# EasyEDA Pro project PixelClock像素时钟-开源Pix24-O.eprj, schematic Schematic
Create Date: 2024-06-09; Page Name: P1; Project Name: EasyMatrix像素钟_Base; Schematic Name: Schematic; Update Date: 2024-07-29; Company: 嘉立创EDA; Page Size: A4; Version: V1.0
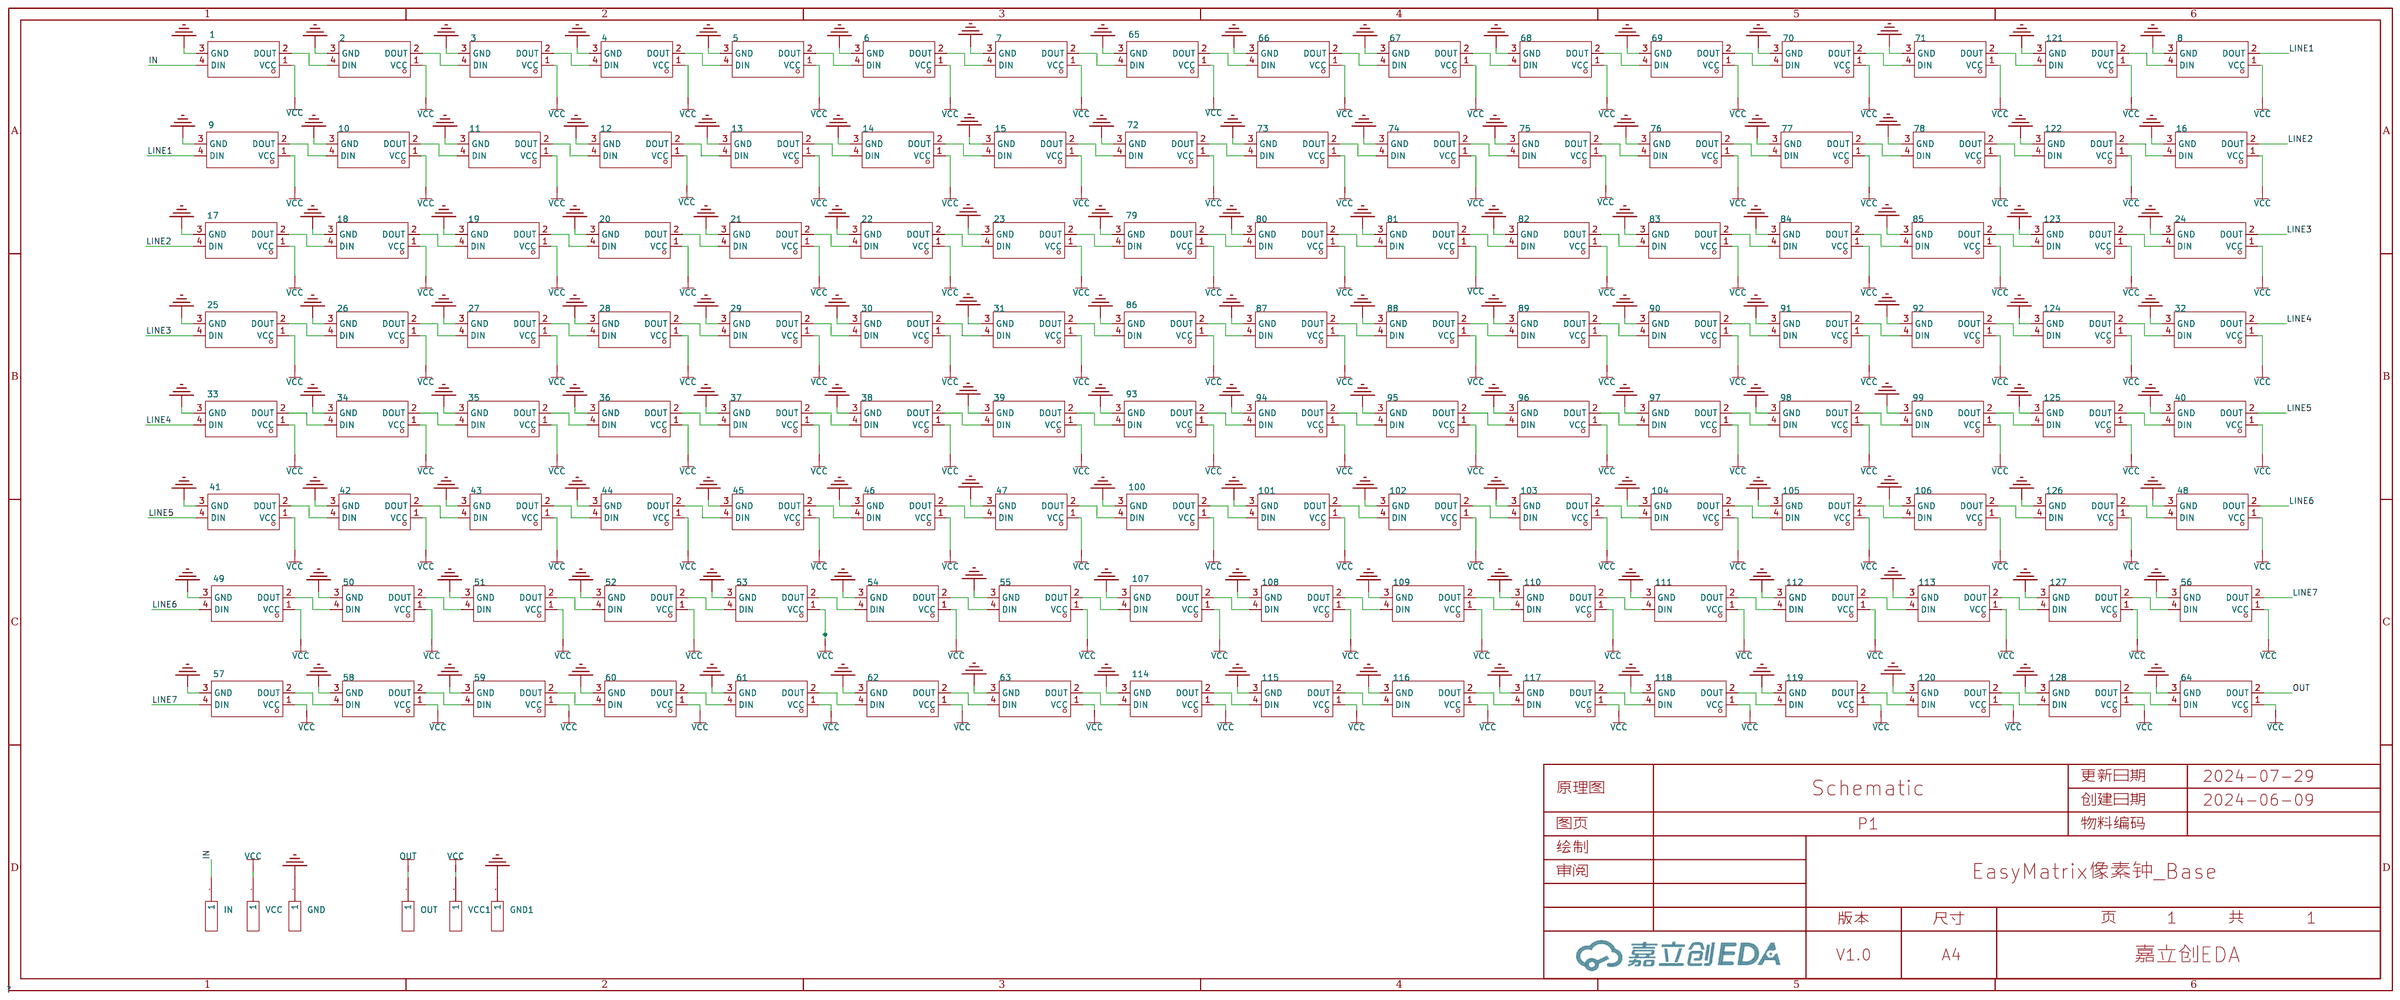
[diagram p0: schematic sheet]

## Parts
1  XL-3528RGBW-WS2812B  [LED-SMD_4P-L3.5-W2.8-BR-1]
2  XL-3528RGBW-WS2812B  [LED-SMD_4P-L3.5-W2.8-BR-1]
3  XL-3528RGBW-WS2812B  [LED-SMD_4P-L3.5-W2.8-BR-1]
4  XL-3528RGBW-WS2812B  [LED-SMD_4P-L3.5-W2.8-BR-1]
5  XL-3528RGBW-WS2812B  [LED-SMD_4P-L3.5-W2.8-BR-1]
6  XL-3528RGBW-WS2812B  [LED-SMD_4P-L3.5-W2.8-BR-1]
7  XL-3528RGBW-WS2812B  [LED-SMD_4P-L3.5-W2.8-BR-1]
8  XL-3528RGBW-WS2812B  [LED-SMD_4P-L3.5-W2.8-BR-1]
9  XL-3528RGBW-WS2812B  [LED-SMD_4P-L3.5-W2.8-BR-1]
10  XL-3528RGBW-WS2812B  [LED-SMD_4P-L3.5-W2.8-BR-1]
11  XL-3528RGBW-WS2812B  [LED-SMD_4P-L3.5-W2.8-BR-1]
12  XL-3528RGBW-WS2812B  [LED-SMD_4P-L3.5-W2.8-BR-1]
13  XL-3528RGBW-WS2812B  [LED-SMD_4P-L3.5-W2.8-BR-1]
14  XL-3528RGBW-WS2812B  [LED-SMD_4P-L3.5-W2.8-BR-1]
15  XL-3528RGBW-WS2812B  [LED-SMD_4P-L3.5-W2.8-BR-1]
16  XL-3528RGBW-WS2812B  [LED-SMD_4P-L3.5-W2.8-BR-1]
17  XL-3528RGBW-WS2812B  [LED-SMD_4P-L3.5-W2.8-BR-1]
18  XL-3528RGBW-WS2812B  [LED-SMD_4P-L3.5-W2.8-BR-1]
19  XL-3528RGBW-WS2812B  [LED-SMD_4P-L3.5-W2.8-BR-1]
20  XL-3528RGBW-WS2812B  [LED-SMD_4P-L3.5-W2.8-BR-1]
21  XL-3528RGBW-WS2812B  [LED-SMD_4P-L3.5-W2.8-BR-1]
22  XL-3528RGBW-WS2812B  [LED-SMD_4P-L3.5-W2.8-BR-1]
23  XL-3528RGBW-WS2812B  [LED-SMD_4P-L3.5-W2.8-BR-1]
24  XL-3528RGBW-WS2812B  [LED-SMD_4P-L3.5-W2.8-BR-1]
25  XL-3528RGBW-WS2812B  [LED-SMD_4P-L3.5-W2.8-BR-1]
26  XL-3528RGBW-WS2812B  [LED-SMD_4P-L3.5-W2.8-BR-1]
27  XL-3528RGBW-WS2812B  [LED-SMD_4P-L3.5-W2.8-BR-1]
28  XL-3528RGBW-WS2812B  [LED-SMD_4P-L3.5-W2.8-BR-1]
29  XL-3528RGBW-WS2812B  [LED-SMD_4P-L3.5-W2.8-BR-1]
30  XL-3528RGBW-WS2812B  [LED-SMD_4P-L3.5-W2.8-BR-1]
31  XL-3528RGBW-WS2812B  [LED-SMD_4P-L3.5-W2.8-BR-1]
32  XL-3528RGBW-WS2812B  [LED-SMD_4P-L3.5-W2.8-BR-1]
33  XL-3528RGBW-WS2812B  [LED-SMD_4P-L3.5-W2.8-BR-1]
34  XL-3528RGBW-WS2812B  [LED-SMD_4P-L3.5-W2.8-BR-1]
35  XL-3528RGBW-WS2812B  [LED-SMD_4P-L3.5-W2.8-BR-1]
36  XL-3528RGBW-WS2812B  [LED-SMD_4P-L3.5-W2.8-BR-1]
37  XL-3528RGBW-WS2812B  [LED-SMD_4P-L3.5-W2.8-BR-1]
38  XL-3528RGBW-WS2812B  [LED-SMD_4P-L3.5-W2.8-BR-1]
39  XL-3528RGBW-WS2812B  [LED-SMD_4P-L3.5-W2.8-BR-1]
40  XL-3528RGBW-WS2812B  [LED-SMD_4P-L3.5-W2.8-BR-1]
41  XL-3528RGBW-WS2812B  [LED-SMD_4P-L3.5-W2.8-BR-1]
42  XL-3528RGBW-WS2812B  [LED-SMD_4P-L3.5-W2.8-BR-1]
43  XL-3528RGBW-WS2812B  [LED-SMD_4P-L3.5-W2.8-BR-1]
44  XL-3528RGBW-WS2812B  [LED-SMD_4P-L3.5-W2.8-BR-1]
45  XL-3528RGBW-WS2812B  [LED-SMD_4P-L3.5-W2.8-BR-1]
46  XL-3528RGBW-WS2812B  [LED-SMD_4P-L3.5-W2.8-BR-1]
47  XL-3528RGBW-WS2812B  [LED-SMD_4P-L3.5-W2.8-BR-1]
48  XL-3528RGBW-WS2812B  [LED-SMD_4P-L3.5-W2.8-BR-1]
49  XL-3528RGBW-WS2812B  [LED-SMD_4P-L3.5-W2.8-BR-1]
50  XL-3528RGBW-WS2812B  [LED-SMD_4P-L3.5-W2.8-BR-1]
51  XL-3528RGBW-WS2812B  [LED-SMD_4P-L3.5-W2.8-BR-1]
52  XL-3528RGBW-WS2812B  [LED-SMD_4P-L3.5-W2.8-BR-1]
53  XL-3528RGBW-WS2812B  [LED-SMD_4P-L3.5-W2.8-BR-1]
54  XL-3528RGBW-WS2812B  [LED-SMD_4P-L3.5-W2.8-BR-1]
55  XL-3528RGBW-WS2812B  [LED-SMD_4P-L3.5-W2.8-BR-1]
56  XL-3528RGBW-WS2812B  [LED-SMD_4P-L3.5-W2.8-BR-1]
57  XL-3528RGBW-WS2812B  [LED-SMD_4P-L3.5-W2.8-BR-1]
58  XL-3528RGBW-WS2812B  [LED-SMD_4P-L3.5-W2.8-BR-1]
59  XL-3528RGBW-WS2812B  [LED-SMD_4P-L3.5-W2.8-BR-1]
60  XL-3528RGBW-WS2812B  [LED-SMD_4P-L3.5-W2.8-BR-1]
61  XL-3528RGBW-WS2812B  [LED-SMD_4P-L3.5-W2.8-BR-1]
62  XL-3528RGBW-WS2812B  [LED-SMD_4P-L3.5-W2.8-BR-1]
63  XL-3528RGBW-WS2812B  [LED-SMD_4P-L3.5-W2.8-BR-1]
64  XL-3528RGBW-WS2812B  [LED-SMD_4P-L3.5-W2.8-BR-1]
65  XL-3528RGBW-WS2812B  [LED-SMD_4P-L3.5-W2.8-BR-1]
66  XL-3528RGBW-WS2812B  [LED-SMD_4P-L3.5-W2.8-BR-1]
67  XL-3528RGBW-WS2812B  [LED-SMD_4P-L3.5-W2.8-BR-1]
68  XL-3528RGBW-WS2812B  [LED-SMD_4P-L3.5-W2.8-BR-1]
69  XL-3528RGBW-WS2812B  [LED-SMD_4P-L3.5-W2.8-BR-1]
70  XL-3528RGBW-WS2812B  [LED-SMD_4P-L3.5-W2.8-BR-1]
71  XL-3528RGBW-WS2812B  [LED-SMD_4P-L3.5-W2.8-BR-1]
72  XL-3528RGBW-WS2812B  [LED-SMD_4P-L3.5-W2.8-BR-1]
73  XL-3528RGBW-WS2812B  [LED-SMD_4P-L3.5-W2.8-BR-1]
74  XL-3528RGBW-WS2812B  [LED-SMD_4P-L3.5-W2.8-BR-1]
75  XL-3528RGBW-WS2812B  [LED-SMD_4P-L3.5-W2.8-BR-1]
76  XL-3528RGBW-WS2812B  [LED-SMD_4P-L3.5-W2.8-BR-1]
77  XL-3528RGBW-WS2812B  [LED-SMD_4P-L3.5-W2.8-BR-1]
78  XL-3528RGBW-WS2812B  [LED-SMD_4P-L3.5-W2.8-BR-1]
79  XL-3528RGBW-WS2812B  [LED-SMD_4P-L3.5-W2.8-BR-1]
80  XL-3528RGBW-WS2812B  [LED-SMD_4P-L3.5-W2.8-BR-1]
81  XL-3528RGBW-WS2812B  [LED-SMD_4P-L3.5-W2.8-BR-1]
82  XL-3528RGBW-WS2812B  [LED-SMD_4P-L3.5-W2.8-BR-1]
83  XL-3528RGBW-WS2812B  [LED-SMD_4P-L3.5-W2.8-BR-1]
84  XL-3528RGBW-WS2812B  [LED-SMD_4P-L3.5-W2.8-BR-1]
85  XL-3528RGBW-WS2812B  [LED-SMD_4P-L3.5-W2.8-BR-1]
86  XL-3528RGBW-WS2812B  [LED-SMD_4P-L3.5-W2.8-BR-1]
87  XL-3528RGBW-WS2812B  [LED-SMD_4P-L3.5-W2.8-BR-1]
88  XL-3528RGBW-WS2812B  [LED-SMD_4P-L3.5-W2.8-BR-1]
89  XL-3528RGBW-WS2812B  [LED-SMD_4P-L3.5-W2.8-BR-1]
90  XL-3528RGBW-WS2812B  [LED-SMD_4P-L3.5-W2.8-BR-1]
91  XL-3528RGBW-WS2812B  [LED-SMD_4P-L3.5-W2.8-BR-1]
92  XL-3528RGBW-WS2812B  [LED-SMD_4P-L3.5-W2.8-BR-1]
93  XL-3528RGBW-WS2812B  [LED-SMD_4P-L3.5-W2.8-BR-1]
94  XL-3528RGBW-WS2812B  [LED-SMD_4P-L3.5-W2.8-BR-1]
95  XL-3528RGBW-WS2812B  [LED-SMD_4P-L3.5-W2.8-BR-1]
96  XL-3528RGBW-WS2812B  [LED-SMD_4P-L3.5-W2.8-BR-1]
97  XL-3528RGBW-WS2812B  [LED-SMD_4P-L3.5-W2.8-BR-1]
98  XL-3528RGBW-WS2812B  [LED-SMD_4P-L3.5-W2.8-BR-1]
99  XL-3528RGBW-WS2812B  [LED-SMD_4P-L3.5-W2.8-BR-1]
100  XL-3528RGBW-WS2812B  [LED-SMD_4P-L3.5-W2.8-BR-1]
101  XL-3528RGBW-WS2812B  [LED-SMD_4P-L3.5-W2.8-BR-1]
102  XL-3528RGBW-WS2812B  [LED-SMD_4P-L3.5-W2.8-BR-1]
103  XL-3528RGBW-WS2812B  [LED-SMD_4P-L3.5-W2.8-BR-1]
104  XL-3528RGBW-WS2812B  [LED-SMD_4P-L3.5-W2.8-BR-1]
105  XL-3528RGBW-WS2812B  [LED-SMD_4P-L3.5-W2.8-BR-1]
106  XL-3528RGBW-WS2812B  [LED-SMD_4P-L3.5-W2.8-BR-1]
107  XL-3528RGBW-WS2812B  [LED-SMD_4P-L3.5-W2.8-BR-1]
108  XL-3528RGBW-WS2812B  [LED-SMD_4P-L3.5-W2.8-BR-1]
109  XL-3528RGBW-WS2812B  [LED-SMD_4P-L3.5-W2.8-BR-1]
110  XL-3528RGBW-WS2812B  [LED-SMD_4P-L3.5-W2.8-BR-1]
111  XL-3528RGBW-WS2812B  [LED-SMD_4P-L3.5-W2.8-BR-1]
112  XL-3528RGBW-WS2812B  [LED-SMD_4P-L3.5-W2.8-BR-1]
113  XL-3528RGBW-WS2812B  [LED-SMD_4P-L3.5-W2.8-BR-1]
114  XL-3528RGBW-WS2812B  [LED-SMD_4P-L3.5-W2.8-BR-1]
115  XL-3528RGBW-WS2812B  [LED-SMD_4P-L3.5-W2.8-BR-1]
116  XL-3528RGBW-WS2812B  [LED-SMD_4P-L3.5-W2.8-BR-1]
117  XL-3528RGBW-WS2812B  [LED-SMD_4P-L3.5-W2.8-BR-1]
118  XL-3528RGBW-WS2812B  [LED-SMD_4P-L3.5-W2.8-BR-1]
119  XL-3528RGBW-WS2812B  [LED-SMD_4P-L3.5-W2.8-BR-1]
120  XL-3528RGBW-WS2812B  [LED-SMD_4P-L3.5-W2.8-BR-1]
121  XL-3528RGBW-WS2812B  [LED-SMD_4P-L3.5-W2.8-BR-1]
122  XL-3528RGBW-WS2812B  [LED-SMD_4P-L3.5-W2.8-BR-1]
123  XL-3528RGBW-WS2812B  [LED-SMD_4P-L3.5-W2.8-BR-1]
124  XL-3528RGBW-WS2812B  [LED-SMD_4P-L3.5-W2.8-BR-1]
125  XL-3528RGBW-WS2812B  [LED-SMD_4P-L3.5-W2.8-BR-1]
126  XL-3528RGBW-WS2812B  [LED-SMD_4P-L3.5-W2.8-BR-1]
127  XL-3528RGBW-WS2812B  [LED-SMD_4P-L3.5-W2.8-BR-1]
128  XL-3528RGBW-WS2812B  [LED-SMD_4P-L3.5-W2.8-BR-1]
GND  -  [长圆形单面焊盘]
GND1  -  [长圆形单面焊盘]
IN  -  [长圆形单面焊盘]
OUT  -  [长圆形单面焊盘]
VCC  -  [长圆形单面焊盘]
VCC1  -  [长圆形单面焊盘]

## Library data of the parts
1-128 = XL-3528RGBW-WS2812B: 发光颜色:RGB三色;二极管配置:共阳极;主波长:618nm~623nm；520nm~525nm；467nm~472nm;峰值波长:525nm；623nm；472nm;光通量(25℃时):-;测试电流:20mA;正向电压(VF):3.4V；3.4V；2.4V;发光强度:143mcd；240mcd；845mcd;功率:50mW；50mW；45mW;发光角度:120°;安装方式:正贴;工作温度:-25℃~+80℃;; LCSC Part Name: RGB三色 共阳极 正贴 幻彩; Supplier Part: C2890364; Manufacturer: XINGLIGHT(成兴光); Supplier Footprint: SMD,3.5x2.8x1.85mm; JLCPCB Part Class: 扩展库; Datasheet: https://atta.szlcsc.com/upload/public/pdf/source/20210827/1CA9F253977F45DC01BA0C3D415B306E.pdf; Supplier: LCSC; Emitted Color: RGB三色; Diode Configuration: 共阳极; Dominant Wavelength: 618nm~623nm；520nm~525nm；467nm~472nm; Peak Wavelength: 525nm；623nm；472nm; Forward Current: 20mA; Forward Voltage (VF): 3.4V；3.4V；2.4V; Luminous Intensity: 143mcd；240mcd；845mcd; Power Dissipation: 50mW；50mW；45mW; Viewing Angle: 120°; Mounting Sytle: 正贴; Operating Temperature: -25℃~+80℃
GND GND1 IN OUT VCC VCC1 = 长圆形单面焊盘

## Nets
GND: 1.3(GND) 2.3(GND) 3.3(GND) 4.3(GND) 5.3(GND) 6.3(GND) 7.3(GND) 8.3(GND) 9.3(GND) 10.3(GND) 11.3(GND) 12.3(GND) 13.3(GND) 14.3(GND) 15.3(GND) 16.3(GND) 17.3(GND) 18.3(GND) 19.3(GND) 20.3(GND) 21.3(GND) 22.3(GND) 23.3(GND) 24.3(GND) 25.3(GND) 26.3(GND) 27.3(GND) 28.3(GND) 29.3(GND) 30.3(GND) 31.3(GND) 32.3(GND) 33.3(GND) 34.3(GND) 35.3(GND) 36.3(GND) 37.3(GND) 38.3(GND) 39.3(GND) 40.3(GND) 41.3(GND) 42.3(GND) 43.3(GND) 44.3(GND) 45.3(GND) 46.3(GND) 47.3(GND) 48.3(GND) 49.3(GND) 50.3(GND) 51.3(GND) 52.3(GND) 53.3(GND) 54.3(GND) 55.3(GND) 56.3(GND) 57.3(GND) 58.3(GND) 59.3(GND) 60.3(GND) 61.3(GND) 62.3(GND) 63.3(GND) 64.3(GND) 65.3(GND) 66.3(GND) 67.3(GND) 68.3(GND) 69.3(GND) 70.3(GND) 71.3(GND) 72.3(GND) 73.3(GND) 74.3(GND) 75.3(GND) 76.3(GND) 77.3(GND) 78.3(GND) 79.3(GND) 80.3(GND) 81.3(GND) 82.3(GND) 83.3(GND) 84.3(GND) 85.3(GND) 86.3(GND) 87.3(GND) 88.3(GND) 89.3(GND) 90.3(GND) 91.3(GND) 92.3(GND) 93.3(GND) 94.3(GND) 95.3(GND) 96.3(GND) 97.3(GND) 98.3(GND) 99.3(GND) 100.3(GND) 101.3(GND) 102.3(GND) 103.3(GND) 104.3(GND) 105.3(GND) 106.3(GND) 107.3(GND) 108.3(GND) 109.3(GND) 110.3(GND) 111.3(GND) 112.3(GND) 113.3(GND) 114.3(GND) 115.3(GND) 116.3(GND) 117.3(GND) 118.3(GND) 119.3(GND) 120.3(GND) 121.3(GND) 122.3(GND) 123.3(GND) 124.3(GND) 125.3(GND) 126.3(GND) 127.3(GND) 128.3(GND) GND.1 GND1.1
VCC: 1.1(VCC) 2.1(VCC) 3.1(VCC) 4.1(VCC) 5.1(VCC) 6.1(VCC) 7.1(VCC) 8.1(VCC) 9.1(VCC) 10.1(VCC) 11.1(VCC) 12.1(VCC) 13.1(VCC) 14.1(VCC) 15.1(VCC) 16.1(VCC) 17.1(VCC) 18.1(VCC) 19.1(VCC) 20.1(VCC) 21.1(VCC) 22.1(VCC) 23.1(VCC) 24.1(VCC) 25.1(VCC) 26.1(VCC) 27.1(VCC) 28.1(VCC) 29.1(VCC) 30.1(VCC) 31.1(VCC) 32.1(VCC) 33.1(VCC) 34.1(VCC) 35.1(VCC) 36.1(VCC) 37.1(VCC) 38.1(VCC) 39.1(VCC) 40.1(VCC) 41.1(VCC) 42.1(VCC) 43.1(VCC) 44.1(VCC) 45.1(VCC) 46.1(VCC) 47.1(VCC) 48.1(VCC) 49.1(VCC) 50.1(VCC) 51.1(VCC) 52.1(VCC) 53.1(VCC) 54.1(VCC) 55.1(VCC) 56.1(VCC) 57.1(VCC) 58.1(VCC) 59.1(VCC) 60.1(VCC) 61.1(VCC) 62.1(VCC) 63.1(VCC) 64.1(VCC) 65.1(VCC) 66.1(VCC) 67.1(VCC) 68.1(VCC) 69.1(VCC) 70.1(VCC) 71.1(VCC) 72.1(VCC) 73.1(VCC) 74.1(VCC) 75.1(VCC) 76.1(VCC) 77.1(VCC) 78.1(VCC) 79.1(VCC) 80.1(VCC) 81.1(VCC) 82.1(VCC) 83.1(VCC) 84.1(VCC) 85.1(VCC) 86.1(VCC) 87.1(VCC) 88.1(VCC) 89.1(VCC) 90.1(VCC) 91.1(VCC) 92.1(VCC) 93.1(VCC) 94.1(VCC) 95.1(VCC) 96.1(VCC) 97.1(VCC) 98.1(VCC) 99.1(VCC) 100.1(VCC) 101.1(VCC) 102.1(VCC) 103.1(VCC) 104.1(VCC) 105.1(VCC) 106.1(VCC) 107.1(VCC) 108.1(VCC) 109.1(VCC) 110.1(VCC) 111.1(VCC) 112.1(VCC) 113.1(VCC) 114.1(VCC) 115.1(VCC) 116.1(VCC) 117.1(VCC) 118.1(VCC) 119.1(VCC) 120.1(VCC) 121.1(VCC) 122.1(VCC) 123.1(VCC) 124.1(VCC) 125.1(VCC) 126.1(VCC) 127.1(VCC) 128.1(VCC) VCC.1 VCC1.1
IN: 1.4(DIN) IN.1
LINE1: 8.2(DOUT) 9.4(DIN)
LINE2: 16.2(DOUT) 17.4(DIN)
LINE3: 24.2(DOUT) 25.4(DIN)
LINE4: 32.2(DOUT) 33.4(DIN)
LINE5: 40.2(DOUT) 41.4(DIN)
LINE6: 48.2(DOUT) 49.4(DIN)
LINE7: 56.2(DOUT) 57.4(DIN)
OUT: 64.2(DOUT) OUT.1
$1N1182: 1.2(DOUT) 2.4(DIN)
$1N1185: 2.2(DOUT) 3.4(DIN)
$1N1190: 4.2(DOUT) 5.4(DIN)
$1N1193: 5.2(DOUT) 6.4(DIN)
$1N1194: 3.2(DOUT) 4.4(DIN)
$1N1199: 7.2(DOUT) 65.4(DIN)
$1N1203: 6.2(DOUT) 7.4(DIN)
$1N7369: 9.2(DOUT) 10.4(DIN)
$1N7372: 10.2(DOUT) 11.4(DIN)
$1N7377: 12.2(DOUT) 13.4(DIN)
$1N7380: 13.2(DOUT) 14.4(DIN)
$1N7381: 11.2(DOUT) 12.4(DIN)
$1N7386: 15.2(DOUT) 72.4(DIN)
$1N7387: 14.2(DOUT) 15.4(DIN)
$1N7912: 17.2(DOUT) 18.4(DIN)
$1N7915: 18.2(DOUT) 19.4(DIN)
$1N7920: 20.2(DOUT) 21.4(DIN)
$1N7923: 21.2(DOUT) 22.4(DIN)
$1N7924: 19.2(DOUT) 20.4(DIN)
$1N7929: 23.2(DOUT) 79.4(DIN)
$1N7930: 22.2(DOUT) 23.4(DIN)
$1N8455: 25.2(DOUT) 26.4(DIN)
$1N8458: 26.2(DOUT) 27.4(DIN)
$1N8463: 28.2(DOUT) 29.4(DIN)
$1N8466: 29.2(DOUT) 30.4(DIN)
$1N8467: 27.2(DOUT) 28.4(DIN)
$1N8472: 31.2(DOUT) 86.4(DIN)
$1N8473: 30.2(DOUT) 31.4(DIN)
$1N8998: 33.2(DOUT) 34.4(DIN)
$1N9001: 34.2(DOUT) 35.4(DIN)
$1N9006: 36.2(DOUT) 37.4(DIN)
$1N9009: 37.2(DOUT) 38.4(DIN)
$1N9010: 35.2(DOUT) 36.4(DIN)
$1N9015: 39.2(DOUT) 93.4(DIN)
$1N9016: 38.2(DOUT) 39.4(DIN)
$1N9541: 41.2(DOUT) 42.4(DIN)
$1N9544: 42.2(DOUT) 43.4(DIN)
$1N9549: 44.2(DOUT) 45.4(DIN)
$1N9552: 45.2(DOUT) 46.4(DIN)
$1N9553: 43.2(DOUT) 44.4(DIN)
$1N9558: 47.2(DOUT) 100.4(DIN)
$1N9559: 46.2(DOUT) 47.4(DIN)
$1N10084: 49.2(DOUT) 50.4(DIN)
$1N10087: 50.2(DOUT) 51.4(DIN)
$1N10092: 52.2(DOUT) 53.4(DIN)
$1N10095: 53.2(DOUT) 54.4(DIN)
$1N10096: 51.2(DOUT) 52.4(DIN)
$1N10101: 55.2(DOUT) 107.4(DIN)
$1N10102: 54.2(DOUT) 55.4(DIN)
$1N10627: 57.2(DOUT) 58.4(DIN)
$1N10630: 58.2(DOUT) 59.4(DIN)
$1N10635: 60.2(DOUT) 61.4(DIN)
$1N10638: 61.2(DOUT) 62.4(DIN)
$1N10639: 59.2(DOUT) 60.4(DIN)
$1N10644: 63.2(DOUT) 114.4(DIN)
$1N10645: 62.2(DOUT) 63.4(DIN)
$1N48094: 65.2(DOUT) 66.4(DIN)
$1N48097: 66.2(DOUT) 67.4(DIN)
$1N48102: 68.2(DOUT) 69.4(DIN)
$1N48105: 69.2(DOUT) 70.4(DIN)
$1N48106: 67.2(DOUT) 68.4(DIN)
$1N48110: 71.2(DOUT) 121.4(DIN)
$1N48111: 70.2(DOUT) 71.4(DIN)
$1N48118: 72.2(DOUT) 73.4(DIN)
$1N48121: 73.2(DOUT) 74.4(DIN)
$1N48126: 75.2(DOUT) 76.4(DIN)
$1N48129: 76.2(DOUT) 77.4(DIN)
$1N48130: 74.2(DOUT) 75.4(DIN)
$1N48134: 78.2(DOUT) 122.4(DIN)
$1N48135: 77.2(DOUT) 78.4(DIN)
$1N48142: 79.2(DOUT) 80.4(DIN)
$1N48145: 80.2(DOUT) 81.4(DIN)
$1N48150: 82.2(DOUT) 83.4(DIN)
$1N48153: 83.2(DOUT) 84.4(DIN)
$1N48154: 81.2(DOUT) 82.4(DIN)
$1N48158: 85.2(DOUT) 123.4(DIN)
$1N48159: 84.2(DOUT) 85.4(DIN)
$1N48166: 86.2(DOUT) 87.4(DIN)
$1N48169: 87.2(DOUT) 88.4(DIN)
$1N48174: 89.2(DOUT) 90.4(DIN)
$1N48177: 90.2(DOUT) 91.4(DIN)
$1N48178: 88.2(DOUT) 89.4(DIN)
$1N48182: 92.2(DOUT) 124.4(DIN)
$1N48183: 91.2(DOUT) 92.4(DIN)
$1N48190: 93.2(DOUT) 94.4(DIN)
$1N48193: 94.2(DOUT) 95.4(DIN)
$1N48198: 96.2(DOUT) 97.4(DIN)
$1N48201: 97.2(DOUT) 98.4(DIN)
$1N48202: 95.2(DOUT) 96.4(DIN)
$1N48206: 99.2(DOUT) 125.4(DIN)
$1N48207: 98.2(DOUT) 99.4(DIN)
$1N48214: 100.2(DOUT) 101.4(DIN)
$1N48217: 101.2(DOUT) 102.4(DIN)
$1N48222: 103.2(DOUT) 104.4(DIN)
$1N48225: 104.2(DOUT) 105.4(DIN)
$1N48226: 102.2(DOUT) 103.4(DIN)
$1N48230: 106.2(DOUT) 126.4(DIN)
$1N48231: 105.2(DOUT) 106.4(DIN)
$1N48238: 107.2(DOUT) 108.4(DIN)
$1N48241: 108.2(DOUT) 109.4(DIN)
$1N48246: 110.2(DOUT) 111.4(DIN)
$1N48249: 111.2(DOUT) 112.4(DIN)
$1N48250: 109.2(DOUT) 110.4(DIN)
$1N48254: 113.2(DOUT) 127.4(DIN)
$1N48255: 112.2(DOUT) 113.4(DIN)
$1N48262: 114.2(DOUT) 115.4(DIN)
$1N48265: 115.2(DOUT) 116.4(DIN)
$1N48270: 117.2(DOUT) 118.4(DIN)
$1N48273: 118.2(DOUT) 119.4(DIN)
$1N48274: 116.2(DOUT) 117.4(DIN)
$1N48278: 120.2(DOUT) 128.4(DIN)
$1N48279: 119.2(DOUT) 120.4(DIN)
$1N49150: 8.4(DIN) 121.2(DOUT)
$1N49153: 16.4(DIN) 122.2(DOUT)
$1N49156: 24.4(DIN) 123.2(DOUT)
$1N49159: 32.4(DIN) 124.2(DOUT)
$1N49162: 40.4(DIN) 125.2(DOUT)
$1N49165: 48.4(DIN) 126.2(DOUT)
$1N49168: 56.4(DIN) 127.2(DOUT)
$1N49171: 64.4(DIN) 128.2(DOUT)
